# EAGLE schematic witch-pulse1 (EAGLE 6.4)
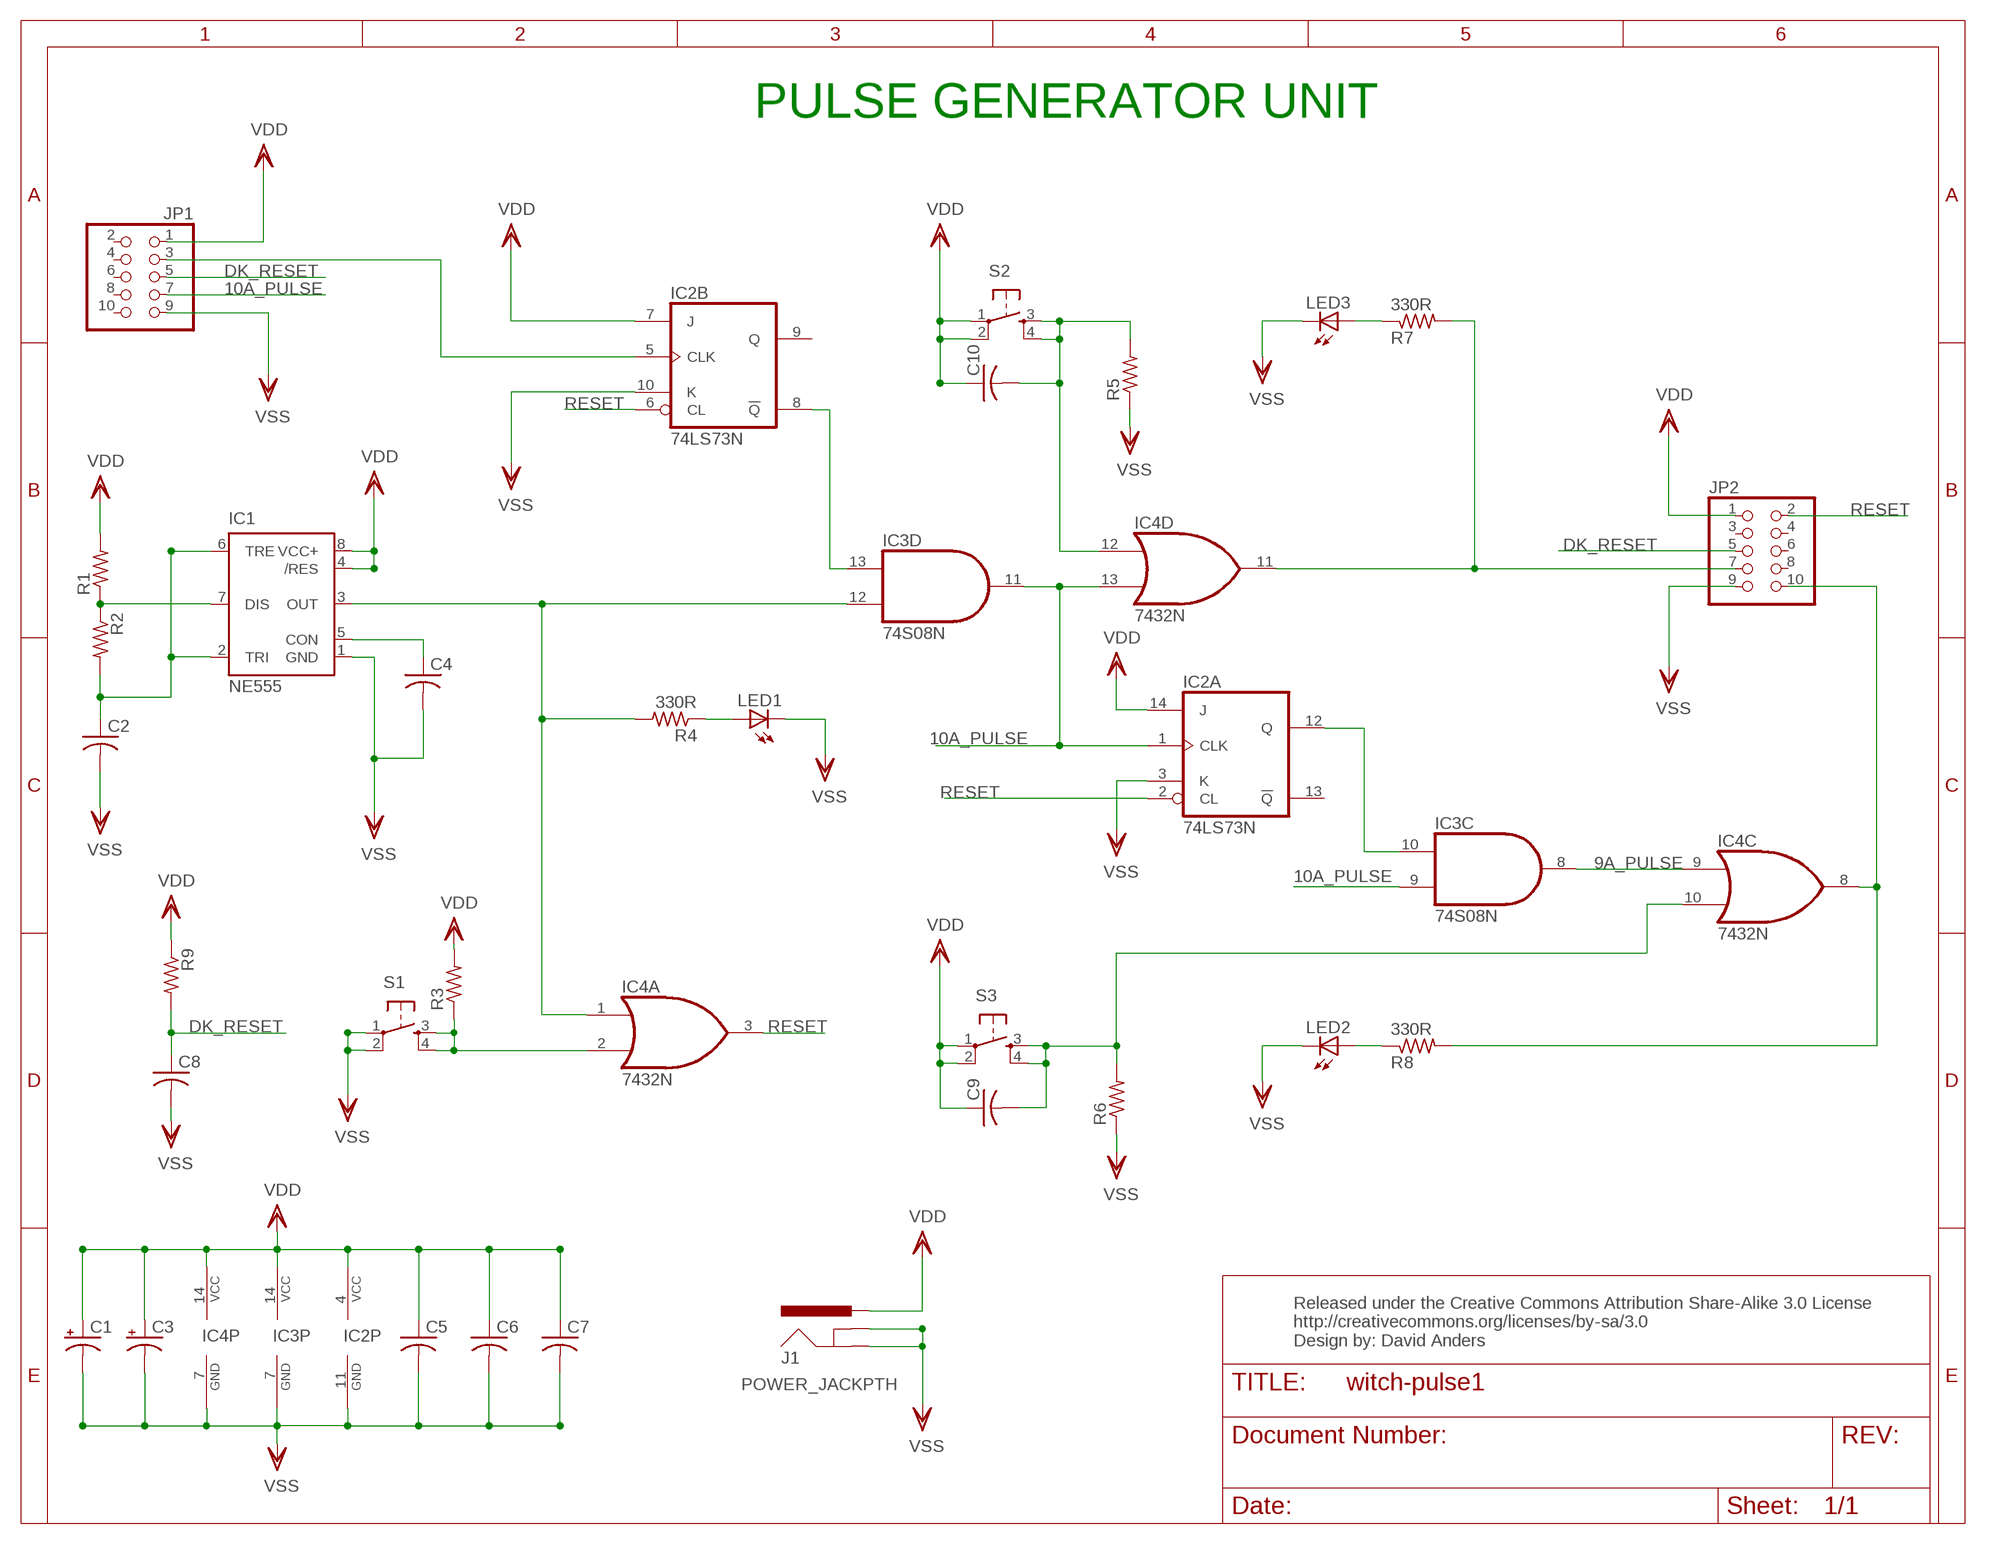
[diagram p0: schematic, sheet 1]

## Parts
C1  CPOL-USE2.5-5  [E2,5-5]
C2  C-US025-040X050  [C025-040X050]
C3  CPOL-USE2.5-5  [E2,5-5]
C4  C-US025-025X050  [C025-025X050]
C5  C-US025-025X050  [C025-025X050]
C6  C-US025-025X050  [C025-025X050]
C7  C-US025-025X050  [C025-025X050]
C8  C-US025-040X050  [C025-040X050]
C9  C-US025-025X050  [C025-025X050]
C10  C-US025-025X050  [C025-025X050]
IC1  NE555  [DIL-08]
IC2  74LS73N  [DIL14]
IC3  74S08N  [DIL14]
IC4  7432N  [DIL14]
J1  POWER_JACKPTH  [POWER_JACK_PTH]
JP1  PINHD-2X5  [2X05]
JP2  PINHD-2X5  [2X05]
LED1  LED5MM  [LED5MM]
LED2  LED5MM  [LED5MM]
LED3  LED5MM  [LED5MM]
R1  R-US_0204/5  [0204/5]
R2  R-US_0204/5  [0204/5]
R3  R-US_0204/5  [0204/5]
R4  330R  R-US_0204/5  [0204/5]
R5  R-US_0204/5  [0204/5]
R6  R-US_0204/5  [0204/5]
R7  330R  R-US_0204/5  [0204/5]
R8  330R  R-US_0204/5  [0204/5]
R9  R-US_0204/5  [0204/5]
S1  TAC_SWITCHPTH  [TACTILE-PTH]
S2  TAC_SWITCHPTH  [TACTILE-PTH]
S3  TAC_SWITCHPTH  [TACTILE-PTH]

## Nets
9A_PULSE: IC3.8(C:O) IC4.9(C:I0)
10A_PULSE: IC2.1(A:CLK) IC3.9(C:I0) IC3.11(D:O) IC4.13(D:I1) JP1.7
DK_RESET: C8.1 JP1.5 JP2.5 R9.2
N$1: IC4.2(A:I1) R3.1 S1.3 S1.4
N$2: IC1.3(OUT) IC3.12(D:I0) IC4.1(A:I0) R4.2
N$4: IC4.8(C:O) JP2.10 R8.2
N$5: IC2.8(B:!Q) IC3.13(D:I1)
N$6: C10.2 IC4.12(D:I0) R5.2 S2.3 S2.4
N$7: IC2.12(A:Q) IC3.10(C:I1)
N$9: C9.2 IC4.10(C:I1) R6.2 S3.3 S3.4
N$10: IC1.7(DIS) R1.1 R2.1
N$12: IC2.5(B:CLK) JP1.3
N$13: C2.1 IC1.2(TRI) IC1.6(TRE) R2.2
N$14: C4.1 IC1.5(CON)
N$15: LED1.A R4.1
N$17: LED3.A R7.1
N$18: LED2.A R8.1
N$19: IC4.11(D:O) JP2.7 R7.2
RESET: IC2.2(A:CL) IC2.6(B:CL) IC4.3(A:O) JP2.2
VDD: C1.+ C3.+ C5.1 C6.1 C7.1 C9.1 IC1.4(/RES) IC1.8(VCC+) IC2.4(P:VCC) IC2.7(B:J) IC2.14(A:J) IC3.14(P:VCC) IC4.14(P:VCC) J1.PWR JP1.1 JP2.1 R1.2 R3.2 R9.1 S2.1 S2.2 S3.1 S3.2
VDD1: C10.1
VSS: C1.- C2.2 C3.- C4.2 C5.2 C6.2 C7.2 C8.2 IC1.1(GND) IC2.3(A:K) IC2.10(B:K) IC2.11(P:GND) IC3.7(P:GND) IC4.7(P:GND) J1.GND J1.GNDBREAK JP1.9 JP2.9 LED1.K(C) LED2.K(C) LED3.K(C) R5.1 R6.1 S1.1 S1.2
Unconnected: IC2.9(B:Q) IC2.13(A:!Q) IC3.1(A:I0) IC3.2(A:I1) IC3.3(A:O) IC3.4(B:I0) IC3.5(B:I1) IC3.6(B:O) IC4.4(B:I0) IC4.5(B:I1) IC4.6(B:O) JP1.2 JP1.4 JP1.6 JP1.8 JP1.10 JP2.3 JP2.4 JP2.6 JP2.8

## Notes on the sheet
- PULSE GENERATOR UNIT
- Released under the Creative Commons Attribution Share-Alike 3.0 License
  http://creativecommons.org/licenses/by-sa/3.0
  Design by: David Anders

## Library data of the parts
C1 C3 = resistor:CPOL-US: POLARIZED CAPACITOR, American symbol
C2 C4-C10 = resistor:C-US: CAPACITOR, American symbol
IC1 = st-microelectronics:NE555: General purpose bipolar Timer; MF: Arrow Electronics; MPN: NE555N; OC_FARNELL: 1467742; OC_NEWARK: 89K1486
IC2 = 74xx-us:74*73: Dual J-K FLIP FLOP, clear
IC3 = 74xx-us:74*08: Quad 2-input AND gate
IC4 = 74xx-us:74*32: Quad 2-input OR gate
J1 = SparkFun-Connectors:POWER_JACK: Power Jack This is the standard 5.5mm barrel jack for power. The PTH is the most common, proven, reliable, footprint. The Slot footprint only works if the mill layer is transmitted to the PCB fab house so be warned. Mating wall wart : TOL-00298 (and others); PROD_ID: PRT-00119
JP1 JP2 = pinhead:PINHD-2X5: PIN HEADER
LED1-LED3 = SparkFun-LED:LED: LEDs Standard schematic elements and footprints for 5mm, 3mm, 1206, and 0603 sized LEDs. 5mm - Spark Fun Electronics SKU : COM-00529 (and others)
R1-R9 = resistor:R-US_: RESISTOR, American symbol
S1-S3 = SparkFun-Electromechanical:TAC_SWITCH: Momentary Switch Button commonly used for reset or general input. Spark Fun Electronics SKU : COM-00097 SMT- SWCH-08247